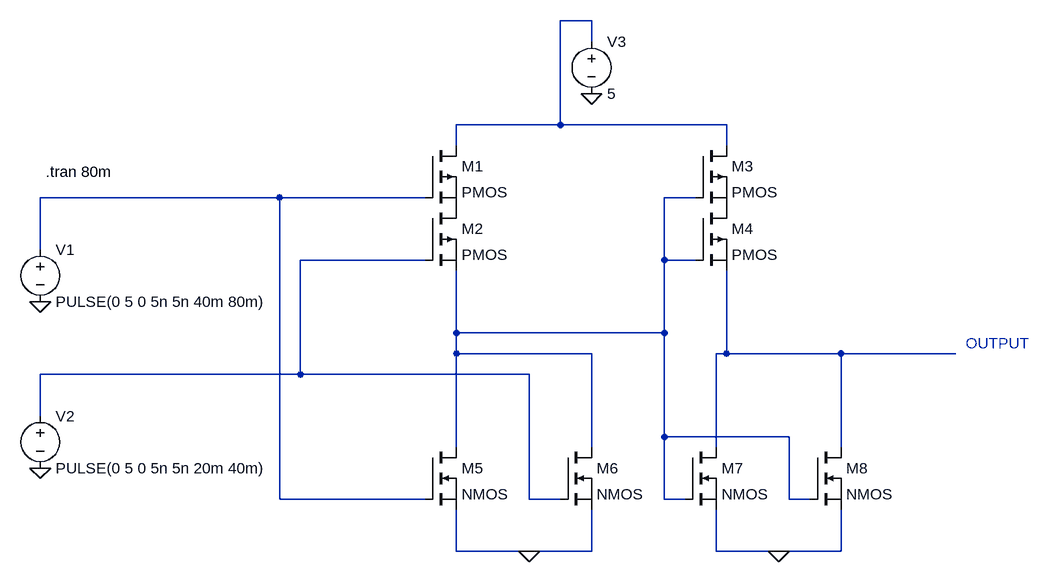
[diagram p0: schematic or-gate-ltspice.asc]
or-gate-ltspice.asc, the LTspice schematic file:
Version 4
SHEET 1 1964 752
WIRE 1296 -80 1248 -80
WIRE 1296 -48 1296 -80
WIRE 1248 80 1248 -80
WIRE 1248 80 1088 80
WIRE 1504 80 1248 80
WIRE 1088 112 1088 80
WIRE 1504 112 1504 80
WIRE 816 192 448 192
WIRE 1040 192 816 192
WIRE 1456 192 1408 192
WIRE 448 272 448 192
WIRE 1040 288 848 288
WIRE 1408 288 1408 192
WIRE 1456 288 1408 288
WIRE 1088 400 1088 304
WIRE 1408 400 1408 288
WIRE 1408 400 1088 400
WIRE 1088 432 1088 400
WIRE 1296 432 1088 432
WIRE 1504 432 1504 304
WIRE 1504 432 1488 432
WIRE 1680 432 1504 432
WIRE 1856 432 1680 432
WIRE 848 464 848 288
WIRE 848 464 448 464
WIRE 1200 464 848 464
WIRE 448 528 448 464
WIRE 1408 560 1408 400
WIRE 1600 560 1408 560
WIRE 1088 576 1088 432
WIRE 1296 576 1296 432
WIRE 1488 576 1488 432
WIRE 1680 576 1680 432
WIRE 816 656 816 192
WIRE 1040 656 816 656
WIRE 1200 656 1200 464
WIRE 1248 656 1200 656
WIRE 1408 656 1408 560
WIRE 1440 656 1408 656
WIRE 1600 656 1600 560
WIRE 1632 656 1600 656
WIRE 1088 736 1088 672
WIRE 1200 736 1088 736
WIRE 1296 736 1296 672
WIRE 1296 736 1200 736
WIRE 1488 736 1488 672
WIRE 1584 736 1488 736
WIRE 1680 736 1680 672
WIRE 1680 736 1584 736
FLAG 1584 736 0
FLAG 1200 736 0
FLAG 1296 32 0
FLAG 448 608 0
FLAG 448 352 0
SYMBOL voltage 448 256 R0
SYMATTR InstName V1
SYMATTR Value PULSE(0 5 0 5n 5n 40m 80m)
SYMBOL voltage 448 512 R0
SYMATTR InstName V2
SYMATTR Value PULSE(0 5 0 5n 5n 20m 40m)
SYMBOL pmos 1040 112 R0
SYMATTR InstName M1
SYMBOL pmos 1040 208 R0
SYMATTR InstName M2
SYMBOL pmos 1456 112 R0
SYMATTR InstName M3
SYMBOL pmos 1456 208 R0
SYMATTR InstName M4
SYMBOL nmos 1040 576 R0
SYMATTR InstName M5
SYMBOL nmos 1248 576 R0
SYMATTR InstName M6
SYMBOL nmos 1440 576 R0
SYMATTR InstName M7
SYMBOL nmos 1632 576 R0
SYMATTR InstName M8
SYMBOL voltage 1296 -64 R0
SYMATTR InstName V3
SYMATTR Value 5
TEXT 456 152 Left 2 !.tran 80m
TEXT 1872 416 Left 2 ;OUTPUT

The netlist it stands for:
* or-gate-ltspice.asc
V1 N002 0 PULSE(0 5 0 5n 5n 40m 80m)
V2 N004 0 PULSE(0 5 0 5n 5n 20m 40m)
M1 N001 N002 P001 P001 PMOS
M2 P001 N004 N003 N003 PMOS
M3 N001 N003 P002 P002 PMOS
M4 P002 N003 N005 N005 PMOS
M5 N003 N002 0 0 NMOS
M6 N003 N004 0 0 NMOS
M7 N005 N003 0 0 NMOS
M8 N005 N003 0 0 NMOS
V3 N001 0 5
.model NMOS NMOS
.model PMOS PMOS
.lib standard.mos
.tran 80m
* OUTPUT
.backanno
.end